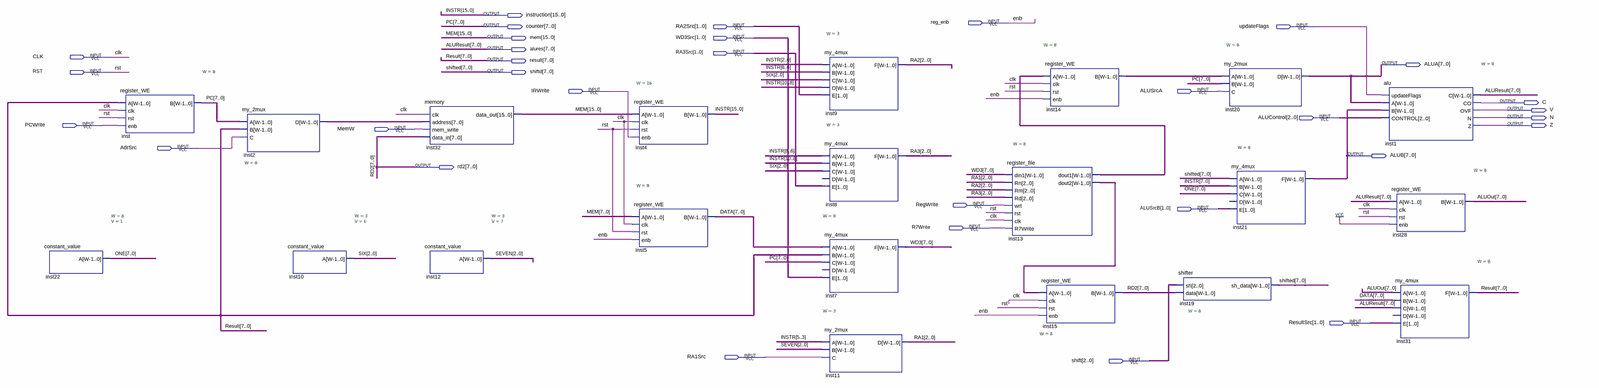
[diagram p0: schematic sheet, whole]
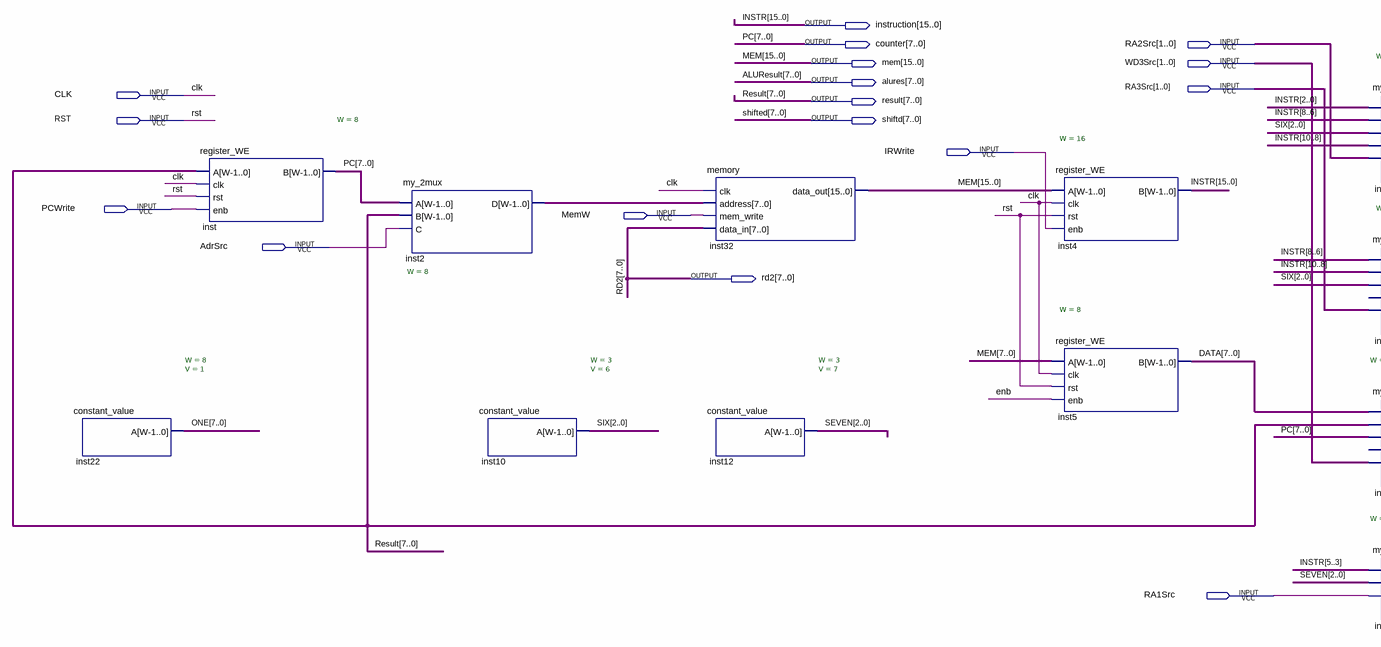
[diagram p1: schematic sheet, left part]
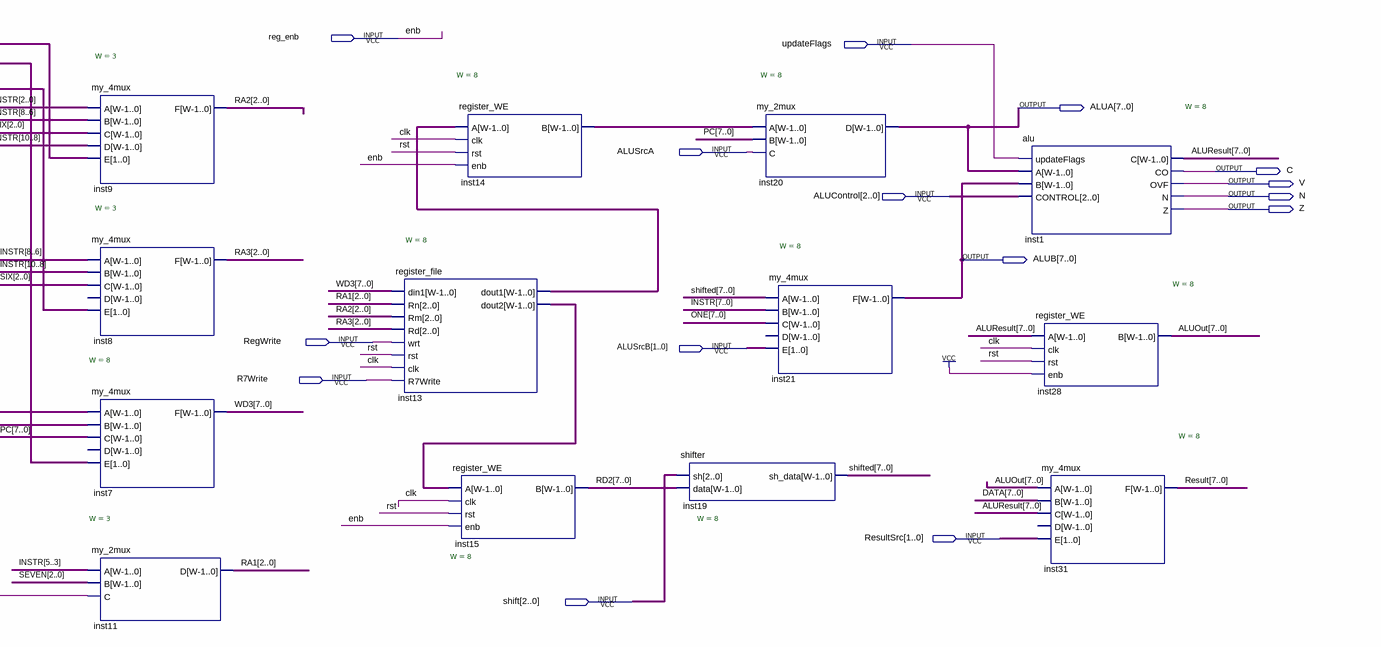
[diagram p2: schematic sheet, right part]
// Quartus schematic datapath.bdf as structural Verilog: 21 symbols, 32 pins
module datapath (
  input  reg_enb,
  input  [1:0] RA2Src,
  input  updateFlags,
  input  [1:0] WD3Src,
  input  [1:0] RA3Src,
  input  CLK,
  input  RST,
  input  IRWrite,
  input  ALUSrcA,
  input  [2:0] ALUControl,
  input  PCWrite,
  input  MemW,
  input  AdrSrc,
  input  RegWrite,
  input  [1:0] ALUSrcB,
  input  R7Write,
  input  [1:0] ResultSrc,
  input  RA1Src,
  input  [2:0] shift,
  output [15:0] instruction,
  output [7:0] counter,
  output [15:0] mem,
  output [7:0] alures,
  output [7:0] result,
  output [7:0] ALUA,
  output [7:0] shiftd,
  output C,
  output V,
  output N,
  output Z,
  output [7:0] ALUB,
  output [7:0] rd2
);

  wire [2:0] RA1, RA2, RA3, SEVEN, SIX;
  wire [7:0] ALUOut, DATA, inst2_d, inst13_dout1, inst13_dout2, inst14_b, ONE, WD3;

  constant_value #(.W(8), .V(1)) inst22 (.A(ONE));
  register_WE #(.W(8)) inst (.A(result), .clk(CLK), .rst(RST), .enb(PCWrite), .B(counter));
  my_2mux #(.W(8)) inst2 (.A(counter), .B(result), .C(AdrSrc), .D(inst2_d));
  constant_value #(.W(3), .V(6)) inst10 (.A(SIX));
  memory inst32 (.clk(CLK), .address(inst2_d), .mem_write(MemW), .data_in(rd2), .data_out(mem));
  constant_value #(.W(3), .V(7)) inst12 (.A(SEVEN));
  register_WE #(.W(16)) inst4 (.A(mem), .clk(CLK), .rst(RST), .enb(IRWrite), .B(instruction));
  register_WE #(.W(8)) inst5 (.A(mem[7:0]), .clk(CLK), .rst(RST), .enb(reg_enb), .B(DATA));
  my_4mux #(.W(3)) inst9 (
    .A(instruction[2:0]), .B(instruction[8:6]), .C(SIX), .D(instruction[10:8]), .E(RA2Src), .F(RA2));
  my_4mux #(.W(3)) inst8 (.A(instruction[8:6]), .B(instruction[10:8]), .C(SIX), .E(RA3Src), .F(RA3));  // open: D
  my_4mux #(.W(8)) inst7 (.A(DATA), .B(result), .C(counter), .E(WD3Src), .F(WD3));  // open: D
  my_2mux #(.W(3)) inst11 (.A(instruction[5:3]), .B(SEVEN), .C(RA1Src), .D(RA1));
  register_file #(.W(8)) inst13 (
    .din1(WD3), .Rn(RA1), .Rm(RA2), .Rd(RA3), .wrt(RegWrite), .rst(RST), .clk(CLK), .R7Write(R7Write),
    .dout1(inst13_dout1), .dout2(inst13_dout2));
  register_WE #(.W(8)) inst14 (.A(inst13_dout1), .clk(CLK), .rst(RST), .enb(reg_enb), .B(inst14_b));
  register_WE #(.W(8)) inst15 (.A(inst13_dout2), .clk(CLK), .rst(RST), .enb(reg_enb), .B(rd2));
  shifter #(.W(8)) inst19 (.sh(shift), .data(rd2), .sh_data(shiftd));
  my_2mux #(.W(8)) inst20 (.A(inst14_b), .B(counter), .C(ALUSrcA), .D(ALUA));
  my_4mux #(.W(8)) inst21 (.A(shiftd), .B(instruction[7:0]), .C(ONE), .E(ALUSrcB), .F(ALUB));  // open: D
  alu #(.W(8)) inst1 (
    .updateFlags(updateFlags), .A(ALUA), .B(ALUB), .CONTROL(ALUControl), .C(alures), .CO(C), .OVF(V), .N(N),
    .Z(Z));
  register_WE #(.W(8)) inst28 (.A(alures), .clk(CLK), .rst(RST), .enb(1'b1), .B(ALUOut));
  my_4mux #(.W(8)) inst31 (.A(ALUOut), .B(DATA), .C(alures), .E(ResultSrc), .F(result));  // open: D

  // Other names for the same wires on the sheet: ALUResult[7:0] = alures; enb = reg_enb; INSTR[15:0] = instruction;
  //   PC[7:0] = counter; shifted[7:0] = shiftd
endmodule
